# Altium project Switch_MCU.PrjPcb
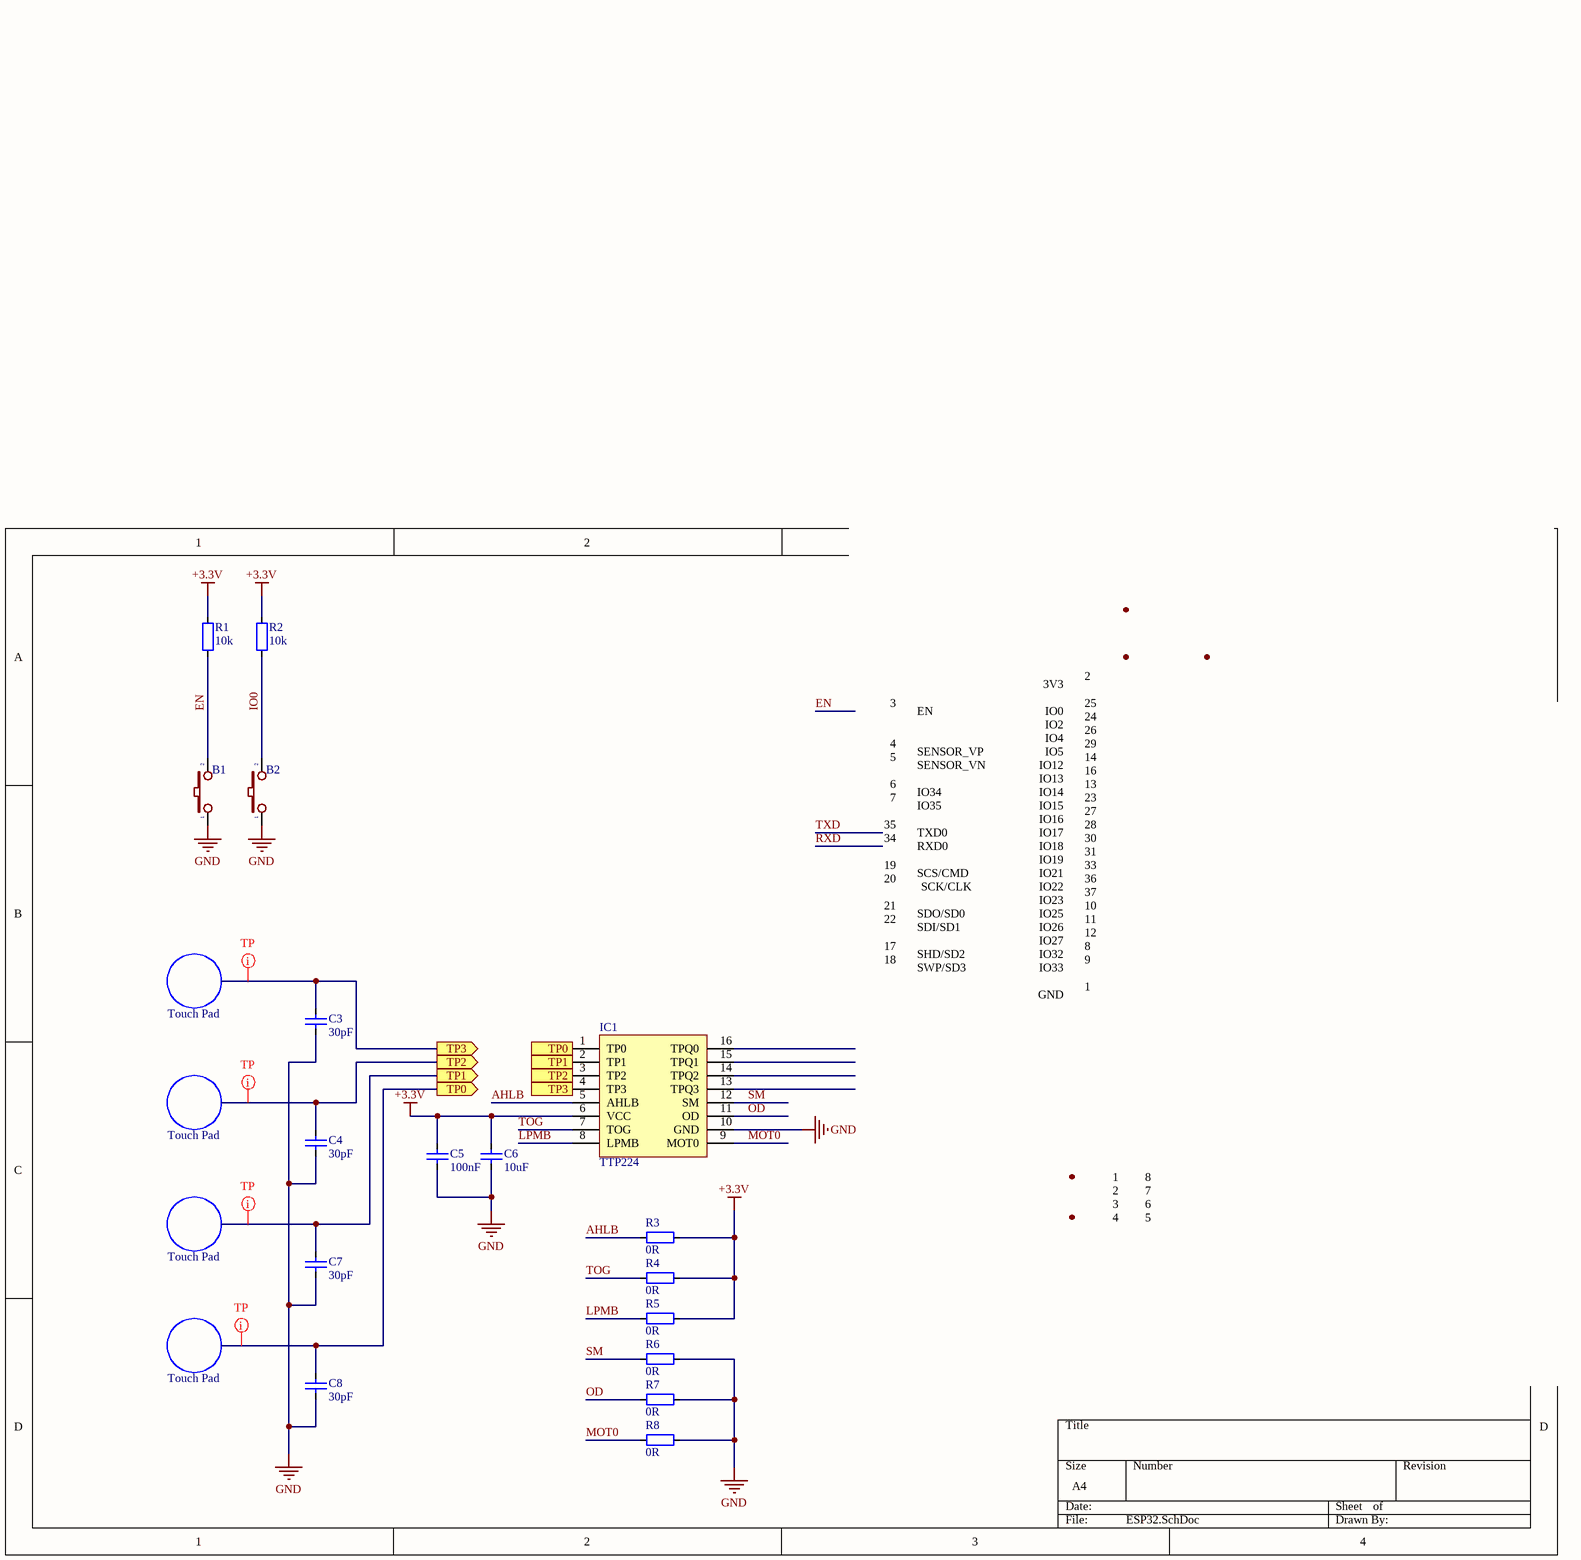
[diagram p0: ESP32.SchDoc]
2 sheets, 32 parts. Net scope: flat (ports and power ports of the same name join across sheets).
Board file: MCU.PcbDoc
Sheets:
  ESP32.SchDoc
  TPS5430.SchDoc

## Sheet ESP32.SchDoc
size A4; SheetNumber: 1; SheetTotal: 2

### Parts
B1  Button 3x4x2.5  [Button 3x4x2.5]  (value not drawn)
B2  Button 3x4x2.5  [Button 3x4x2.5]  (value not drawn)
C1  100nF  [CAP_0805]
C2  10uF  [CAP_0805]
C3  30pF  [CAP_0805]
C4  30pF  [CAP_0805]
C5  100nF  [CAP_0805]
C6  10uF  [CAP_0805]
C7  30pF  [CAP_0805]
C8  30pF  [CAP_0805]
IC1  TTP224  [TTP224]
JP1  JP 2x4 2.54  [JP2x4_PAD]
R1  10k  [RES-SMD-0603]
R2  10k  [RES-SMD-0603]
R3  0R  [RES-SMD-0603]
R4  0R  [RES-SMD-0603]
R5  0R  [RES-SMD-0603]
R6  0R  [RES-SMD-0603]
R7  0R  [RES-SMD-0603]
R8  0R  [RES-SMD-0603]
U1  ESP32-WROOM-32  [MODULE_ESP32-WROOM-32]

### Ports
RL1 (in), RL1 (out), RL2 (in), RL2 (out), RL3 (in), RL3 (out), RL4 (in), RL4 (out), TP0 (in), TP0 (out), TP1 (in), TP1 (out), TP2 (in), TP2 (out), TP3 (in), TP3 (out), TPQ0 (in), TPQ0 (out), TPQ1 (in), TPQ1 (out), TPQ2 (in), TPQ2 (out), TPQ3 (in), TPQ3 (out)

### Nets
+3.3V: C1.1 C2.1 C5.2 C6.2 IC1.6(VCC) R1.1 R2.1 R3.2 R4.2 R5.2 U1.2(3V3)
+12: JP1.1 JP1.2
GND: B1.1 B2.1 C1.2 C2.2 C3.1 C4.1 C5.1 C6.1 C7.1 C8.1 IC1.10(GND) JP1.3 JP1.4 R6.2 R7.2 R8.2 U1.1(GND)
AHLB: IC1.5(AHLB) R3.1
EN: B1.2 R1.2 U1.3(EN)
IO0: B2.2 R2.2 U1.25(IO0)
IO4: IC1.16(TPQ0) U1.26(IO4) ; port TPQ0
IO13: U1.16(IO13)
IO16: JP1.5 U1.27(IO16) ; port RL4
IO17: JP1.6 U1.28(IO17) ; port RL3
IO18: JP1.7 U1.30(IO18) ; port RL2
IO19: JP1.8 U1.31(IO19) ; port RL1
IO21: IC1.15(TPQ1) U1.33(IO21) ; port TPQ1
IO22: IC1.14(TPQ2) U1.36(IO22) ; port TPQ2
IO23: IC1.13(TPQ3) U1.37(IO23) ; port TPQ3
IO25: U1.10(IO25)
IO33: U1.9(IO33)
LPMB: IC1.8(LPMB) R5.1
MOT0: IC1.9(MOT0) R8.1
OD: IC1.11(OD) R7.1
RXD: U1.34(RXD0)
SM: IC1.12(SM) R6.1
TOG: IC1.7(TOG) R4.1
TXD: U1.35(TXD0)
NetC3_2: C3.2 IC1.4(TP3) ; port TP3
NetC4_2: C4.2 IC1.3(TP2) ; port TP2
NetC7_2: C7.2 IC1.2(TP1) ; port TP1
NetC8_2: C8.2 IC1.1(TP0) ; port TP0

Not connected (* = marked no-connect by the designer): U1 4(SENSOR_VP) 5(SENSOR_VN) 6(IO34) 7(IO35) 8(IO32) 11(IO26) 12(IO27) 13(IO14) 14(IO12) 17(SHD/SD2) 18(SWP/SD3) 19(SCS/CMD) 20(SCK/CLK) 21(SDO/SD0) 22(SDI/SD1) 23(IO15) 24(IO2) 29(IO5)

### Layout directives
net class TP: NetC3_2, NetC4_2, NetC7_2, NetC8_2

### Notes on the sheet
- Touch Pad

### Library data of the parts
C1-C8 = CapSMD: Capacitor; Value: 33p; Published: 8-Jun-2000; LatestRevisionDate: 17-Jul-2002; LatestRevisionNote: Re-released for DXP Platform.; PackageReference: RAD-0.3; Publisher: Altium Limited
JP1 = JP 2x4 2.54 Duc Thang: Cắm; Ten_Linh_Kien: Jump Đôi Đực 2.54MM 2x40P Thẳng 11MM; Don_Vi: Con; Ma_Hang: MH002686; Ghi_Chu: *; Kieu_Chan: *; Chung_Loai: Cắm
R1-R8 = Resistor - SMD: Resistor; Manufacturer: Generic Components; Class: Passive; Published: 08/06/2000; Publisher: Altium Hobart Technology Centre
U1 = ESP32-WROOM-32: Bluetooth, WiFi Transceiver Module 2.4GHz ~ 2.5GHz Surface Mount; MF: Espressif Systems; Package: Module Espressif Systems; Digi-Key_Part_Number: 1904-1010-1-ND; Digi-Key_Purchase_URL: https://www.digikey.com/product-detail/en/espressif-systems/ESP32-WROOM-32/1904-1010-1-ND/8544305?utm_source=snapeda&utm_medium=aggregator&utm_campaign=symbol; Value: *; MP: ESP32-WROOM-32; SnapEDA_Link: https://www.snapeda.com/parts/ESP32-WROOM-32/Espressif%20Systems/view-part/2753322/?ref=snap

## Sheet TPS5430.SchDoc
size A; SheetNumber: 2; SheetTotal: 2
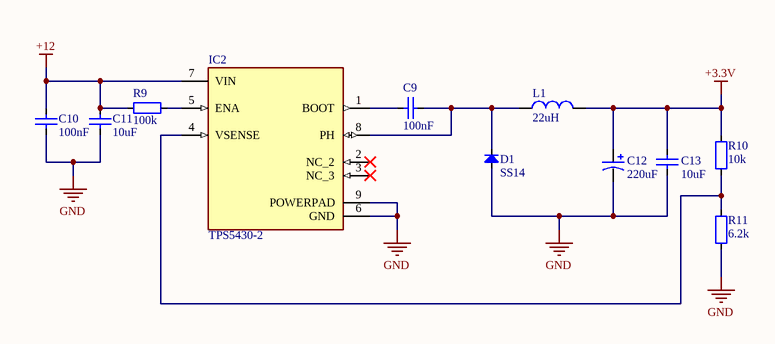
[diagram p1: TPS5430.SchDoc]

### Parts
C9  100nF  [CAP_0805]
C10  100nF  [CAP_0805]
C11  10uF  [CAP_0805]
C12  220uF  [CAP_7343]
C13  10uF  [CAP_0805]
D1  SS14  [DO-214AC(SMA)]
IC2  TPS5430-2  [TPS5430]
L1  22uH  [L_SMD]
R9  100k  [RES-SMD-0805]
R10  10k  [RES-SMD-0805]
R11  6.2k  [RES-SMD-0805]

### Nets
+3.3V: C12.1 C13.1 L1.2 R10.2
+12: C10.2 C11.2 IC2.7(VIN) R9.1
GND: C10.1 C11.1 C12.2 C13.2 D1.1(A) IC2.6(GND) IC2.9(POWERPAD) R11.1
NetC9_1: C9.1 D1.2(K) IC2.8(PH) L1.1
NetC9_2: C9.2 IC2.1(BOOT)
NetIC2_4: IC2.4(VSENSE) R10.1 R11.2
NetIC2_5: IC2.5(ENA) R9.2

Not connected (* = marked no-connect by the designer): IC2 2(NC_2)* 3(NC_3)*

### Library data of the parts
C9-C11 C13 = CapSMD: Capacitor; Value: 33p; Published: 8-Jun-2000; LatestRevisionDate: 17-Jul-2002; LatestRevisionNote: Re-released for DXP Platform.; PackageReference: RAD-0.3; Publisher: Altium Limited
C12 = CAP_TAN_SMD: Polazied Tantalum Capacitor
D1 = Diode SMD: SS34 Diode Schottky 3A 40V SMA(DO-214AC); Code - JEDEC: DO-214-AB; Value: 1N5007; Published: 8-Jun-2000; Revision: July-2002: Re-released for DXP Platform.; Publisher: Altium Limited
L1 = Inductor: CD73R 22uH 1.23A 7345; Value: 150 mH
R9-R11 = Resistor - SMD: as R1 on sheet ESP32; Published: 08/06/2000; Publisher: Altium Hobart Technology Centre

## Nets that join several sheets
+3.3V: ESP32 (11 pins), TPS5430 (C12.1 C13.1 L1.2 R10.2)
+12: ESP32 (JP1.1 JP1.2), TPS5430 (C10.2 C11.2 IC2.7 R9.1)
GND: ESP32 (17 pins), TPS5430 (8 pins)